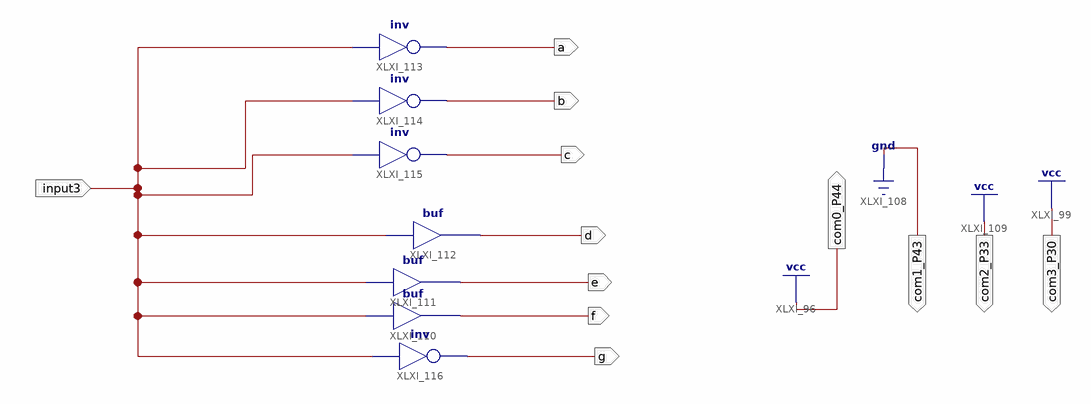
[diagram p0: schematic sheet 1]
// Xilinx ISE schematic L.sch (spartan6) as structural Verilog: 7 symbols, 12 ports
module L (
  input  input3,
  output com1_P43,
  output com2_P33,
  output com0_P44,
  output com3_P30,
  output a,
  output b,
  output c,
  output d,
  output e,
  output f,
  output g
);

  buf XLXI_110 (f, input3);
  buf XLXI_111 (e, input3);
  buf XLXI_112 (d, input3);
  not XLXI_113 (a, input3);
  not XLXI_114 (b, input3);
  not XLXI_115 (c, input3);
  not XLXI_116 (g, input3);

  assign com0_P44 = 1'b1;
  assign com1_P43 = 1'b0;
  assign com2_P33 = 1'b1;
  assign com3_P30 = 1'b1;
endmodule
